# Altium schematic sheet sd_card.SchDoc
size A4
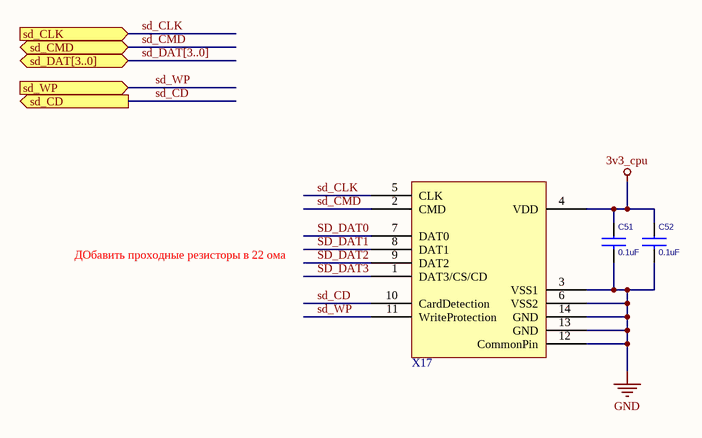
[diagram p0: sd_card.SchDoc]

## Parts
C51  0.1uF  [CAPC2012X09M]
C52  0.1uF  [CAPC2012X09M]
X17  104H-TDA0-R01  [104H-TDA0-R01]  (value not drawn)

## Ports
sd_CD (out), sd_CLK (in), sd_CMD (bidir), sd_DAT[3..0] (bidir), sd_WP (in)

## Nets
3v3_cpu: C51.1 C52.1 X17.4(VDD)
GND: C51.2 C52.2 X17.3(VSS1) X17.6(VSS2) X17.12(CommonPin) X17.13(GND) X17.14(GND)
sd_CD: X17.10(CardDetection) ; port sd_CD
sd_CLK: X17.5(CLK) ; port sd_CLK
sd_CMD: X17.2(CMD) ; port sd_CMD
SD_DAT0: X17.7(DAT0)
SD_DAT1: X17.8(DAT1)
SD_DAT2: X17.9(DAT2)
SD_DAT3: X17.1(DAT3/CS/CD)
sd_WP: X17.11(WriteProtection) ; port sd_WP

## Buses and harness runs
bus sd_DAT[3..0] = port sd_DAT[3..0]

## Notes on the sheet
- ДОбавить проходные резисторы в 22 ома

## Library data of the parts
C51 C52 = CAP_SMD_0.1UF_10%: CAP CER 0.1UF 25V 10% X7R 0805; Value: 0.1uF; Supplier 1: Digi-Key; Supplier Part Number 1: 399-1168-6-ND
X17 = 104H-TDA0-R01: Supplier1: www.voelkner.de; Supplier Part Number 1: Y762531